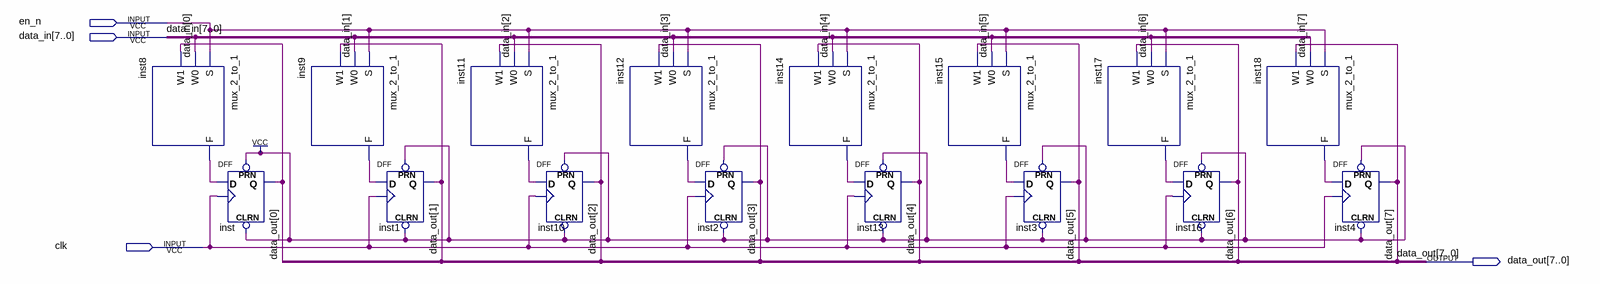
[diagram p0: schematic sheet]
// Quartus schematic reg_8bit.bdf as structural Verilog: 16 symbols, 4 pins
module reg_8bit (
  input  en_n,
  input  [7:0] data_in,
  input  clk,
  output [7:0] data_out
);

  wire inst8_f, inst9_f, inst11_f, inst12_f, inst14_f, inst15_f, inst17_f, inst18_f;

  mux_2_to_1 inst8 (.S(en_n), .W0(data_in[0]), .W1(data_out[0]), .F(inst8_f));
  DFF inst (.CLRN(1'b1), .CLK(clk), .D(inst8_f), .PRN(1'b1), .Q(data_out[0]));
  mux_2_to_1 inst9 (.S(en_n), .W0(data_in[1]), .W1(data_out[1]), .F(inst9_f));
  DFF inst1 (.CLRN(1'b1), .CLK(clk), .D(inst9_f), .PRN(1'b1), .Q(data_out[1]));
  mux_2_to_1 inst11 (.S(en_n), .W0(data_in[2]), .W1(data_out[2]), .F(inst11_f));
  DFF inst10 (.CLRN(1'b1), .CLK(clk), .D(inst11_f), .PRN(1'b1), .Q(data_out[2]));
  mux_2_to_1 inst12 (.S(en_n), .W0(data_in[3]), .W1(data_out[3]), .F(inst12_f));
  DFF inst2 (.CLRN(1'b1), .CLK(clk), .D(inst12_f), .PRN(1'b1), .Q(data_out[3]));
  mux_2_to_1 inst14 (.S(en_n), .W0(data_in[4]), .W1(data_out[4]), .F(inst14_f));
  DFF inst13 (.CLRN(1'b1), .CLK(clk), .D(inst14_f), .PRN(1'b1), .Q(data_out[4]));
  mux_2_to_1 inst15 (.S(en_n), .W0(data_in[5]), .W1(data_out[5]), .F(inst15_f));
  DFF inst3 (.CLRN(1'b1), .CLK(clk), .D(inst15_f), .PRN(1'b1), .Q(data_out[5]));
  mux_2_to_1 inst17 (.S(en_n), .W0(data_in[6]), .W1(data_out[6]), .F(inst17_f));
  DFF inst16 (.CLRN(1'b1), .CLK(clk), .D(inst17_f), .PRN(1'b1), .Q(data_out[6]));
  mux_2_to_1 inst18 (.S(en_n), .W0(data_in[7]), .W1(data_out[7]), .F(inst18_f));
  DFF inst4 (.CLRN(1'b1), .CLK(clk), .D(inst18_f), .PRN(1'b1), .Q(data_out[7]));
endmodule
